# Altium project pi_ups.PrjPcb
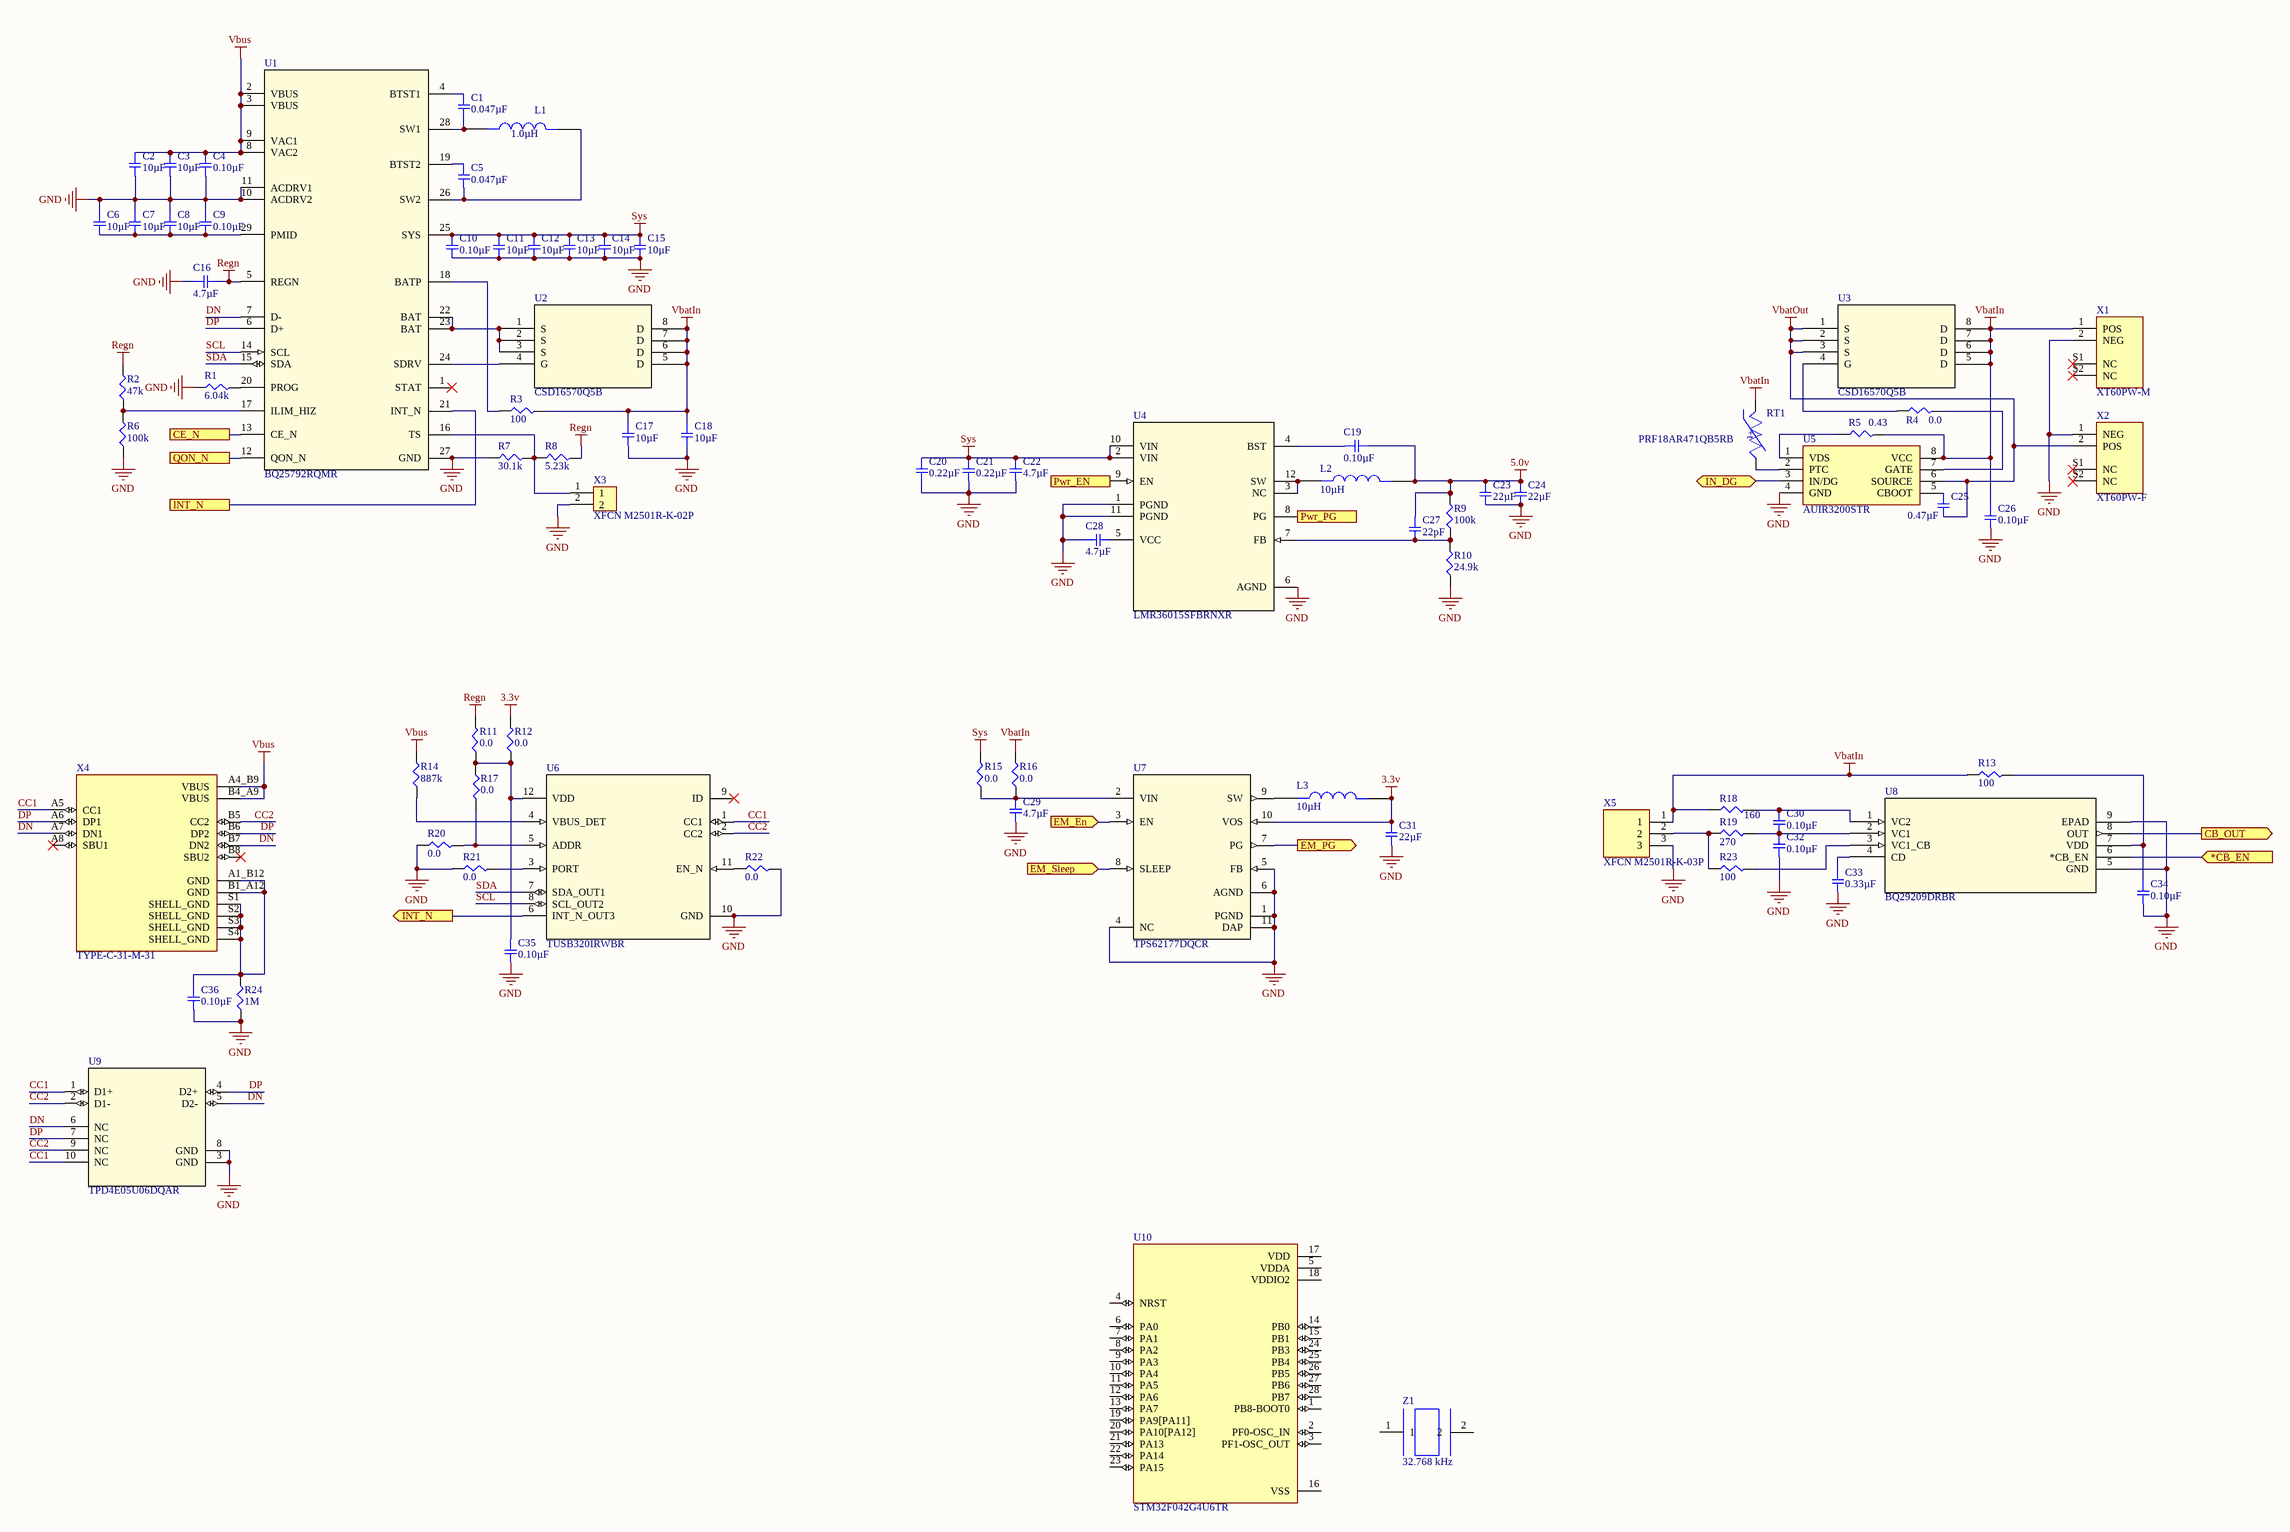
[diagram p0: pi_ups.SchDoc]
1 sheet, 80 parts. Net scope: flat (ports and power ports of the same name join across sheets).

## Sheet pi_ups.SchDoc
size A2; SheetNumber: 1; SheetTotal: 1

### Parts
C1  0.047µF  [SMD-0402C]
C2  10µF  [SMD-0805C]
C3  10µF  [SMD-0805C]
C4  0.10µF  [SMD-0402C]
C5  0.047µF  [SMD-0402C]
C6  10µF  [SMD-0805C]
C7  10µF  [SMD-0805C]
C8  10µF  [SMD-0805C]
C9  0.10µF  [SMD-0402C]
C10  0.10µF  [SMD-0402C]
C11  10µF  [SMD-0805C]
C12  10µF  [SMD-0805C]
C13  10µF  [SMD-0805C]
C14  10µF  [SMD-0805C]
C15  10µF  [SMD-0805C]
C16  4.7µF  [SMD-0805C]
C17  10µF  [SMD-0805C]
C18  10µF  [SMD-0805C]
C19  0.10µF  [SMD-0402C]
C20  0.22µF  [SMD-0603C]
C21  0.22µF  [SMD-0603C]
C22  4.7µF  [SMD-0805C]
C23  22µF  [SMD-0805C]
C24  22µF  [SMD-0805C]
C25  0.47µF  [SMD-0603C]
C26  0.10µF  [SMD-0402C]
C27  22pF  [SMD-0402C]
C28  4.7µF  [SMD-0805C]
C29  4.7µF  [SMD-0805C]
C30  0.10µF  [SMD-0402C]
C31  22µF  [SMD-0805C]
C32  0.10µF  [SMD-0402C]
C33  0.33µF  [SMD-0603C]
C34  0.10µF  [SMD-0402C]
C35  0.10µF  [SMD-0402C]
C36  0.10µF  [SMD-0402C]
L1  1.0µH  [SPM6530T-1R0M120]
L2  10µH  [4020]
L3  10µH  [4020]
R1  6.04k  [SMD-0402-RES]
R2  47k  [SMD-0402-RES]
R3  100  [SMD-0402-RES]
R4  0.0  [SMD-0402-RES]
R5  0.43  [SMD-0402-RES]
R6  100k  [SMD-0402-RES]
R7  30.1k  [SMD-0402-RES]
R8  5.23k  [SMD-0402-RES]
R9  100k  [SMD-0402-RES]
R10  24.9k  [SMD-0402-RES]
R11  0.0  [SMD-0402-RES]
R12  0.0  [SMD-0402-RES]
R13  100  [SMD-0402-RES]
R14  887k  [SMD-0402-RES]
R15  0.0  [SMD-0402-RES]
R16  0.0  [SMD-0402-RES]
R17  0.0  [SMD-0402-RES]
R18  160  [SMD-0402-RES]
R19  270  [SMD-0402-RES]
R20  0.0  [SMD-0402-RES]
R21  0.0  [SMD-0402-RES]
R22  0.0  [SMD-0402-RES]
R23  100  [SMD-0402-RES]
R24  1M  [SMD-0402-RES]
RT1  PRF18AR471QB5RB  [THRMC1608X95N]
U1  BQ25792RQMR  [RQM0029A-MFG]
U2  CSD16570Q5B  [DNK8]
U3  CSD16570Q5B  [DNK8]
U4  LMR36015SFBRNXR  [RNX0012B]
U5  AUIR3200STR  [SOIC127P600X175-8N]
U6  TUSB320IRWBR  [RWB0012A]
U7  TPS62177DQCR  [DQC0010A]
U8  BQ29209DRBR  [DRB8_1P6X2P4]
U9  TPD4E05U06DQAR  [DQA0010A]
U10  STM32F042G4U6TR  [IC_STM32F042G4U6TR]
X1  XT60PW-M  [XT60PW-M]
X2  XT60PW-F  [XT60PW-F]
X3  XFCN M2501R-K-02P  [JST_S2B-XH-A(LF)(SN)]
X4  TYPE-C-31-M-31  [TYPE-C-31-M-31]
X5  XFCN M2501R-K-03P  [JST_S3B-XH-A(LF)(SN)]
Z1  32.768 kHz  [XTAL320X150X90]

### Ports
*CB_EN (in), CB_OUT (out), CE_N, EM_En (in), EM_PG (out), EM_Sleep (in), IN_DG (bidir), INT_N, INT_N (out), Pwr_EN (in), Pwr_PG (out), QON_N

### Nets
3.3v: C31.1 L3.2 R12.2 U7.10(VOS)
5.0v: C19.2 C23.1 C24.1 C27.1 L2.2 R9.2
GND: C2.2 C3.2 C4.2 C6.1 C7.1 C8.1 C9.1 C10.2 C11.2 C12.2 C13.2 C14.2 C15.2 C16.1 C17.2 C18.2 C20.2 C21.2 C22.2 C23.2 C24.2 C26.2 C28.1 C29.2 C31.2 C32.2 C33.2 C34.2 C35.2 C36.2 R1.1 R6.1 R7.1 R10.1 R20.1 R21.1 R22.2 R24.1 U1.10(ACDRV2) U1.11(ACDRV1) U1.27(GND) U4.1(PGND) U4.6(AGND) U4.11(PGND) U5.4(GND) U6.10(GND) U7.1(PGND) U7.4(NC) U7.5(FB) U7.6(AGND) U7.11(DAP) U8.5(GND) U8.9(EPAD) U9.3(GND) U9.8(GND) X1.2(NEG) X2.1(NEG) X3.2 X5.3
Regn: C16.2 R2.2 R8.2 R11.2 U1.5(REGN)
Sys: C10.1 C11.1 C12.1 C13.1 C14.1 C15.1 C20.1 C21.1 C22.1 R15.2 U1.25(SYS) U4.2(VIN) U4.10(VIN)
VbatIn: C17.1 C18.1 C26.1 R3.2 R5.2 R13.1 R16.2 R18.1 RT1.1 U2.5(D) U2.6(D) U2.7(D) U2.8(D) U3.5(D) U3.6(D) U3.7(D) U3.8(D) U5.8(VCC) X1.1(POS) X5.1
VbatOut: C25.2 U3.1(S) U3.2(S) U3.3(S) U5.6(SOURCE) X2.2(POS)
Vbus: C2.1 C3.1 C4.1 R14.2 U1.2(VBUS) U1.3(VBUS) U1.8(VAC2) U1.9(VAC1) X4.A4_B9(VBUS) X4.B4_A9(VBUS)
CC1: U6.1(CC1) U9.1(D1+) U9.10(NC) X4.A5(CC1)
CC2: U6.2(CC2) U9.2(D1-) U9.9(NC) X4.B5(CC2)
DN: U1.7(D-) U9.5(D2-) U9.6(NC) X4.A7(DN1) X4.B7(DN2)
DP: U1.6(D+) U9.4(D2+) U9.7(NC) X4.A6(DP1) X4.B6(DP2)
SCL: U1.14(SCL) U6.8(SCL_OUT2)
SDA: U1.15(SDA) U6.7(SDA_OUT1)
NetC1_1: C1.1 U1.4(BTST1)
NetC1_2: C1.2 L1.1 U1.28(SW1)
NetC5_1: C5.1 U1.19(BTST2)
NetC5_2: C5.2 L1.2 U1.26(SW2)
NetC6_2: C6.2 C7.2 C8.2 C9.2 U1.29(PMID)
NetC19_1: C19.1 U4.4(BST)
NetC25_1: C25.1 U5.5(CBOOT)
NetC27_2: C27.2 R9.1 R10.2 U4.7(FB)
NetC28_2: C28.2 U4.5(VCC)
NetC29_1: C29.1 R15.1 R16.1 U7.2(VIN)
NetC30_1: C30.1 R18.2 U8.1(VC2)
NetC30_2: C30.2 C32.1 R19.2 U8.2(VC1)
NetC33_1: C33.1 U8.4(CD)
NetC34_1: C34.1 R13.2 U8.7(VDD)
NetC35_1: C35.1 R11.1 R12.1 R17.1 U6.12(VDD)
NetC36_1: C36.1 R24.2 X4.A1_B12(GND) X4.B1_A12(GND) X4.S1(SHELL_GND) X4.S2(SHELL_GND) X4.S3(SHELL_GND) X4.S4(SHELL_GND)
NetL2_1: L2.1 U4.3(NC) U4.12(SW)
NetL3_1: L3.1 U7.9(SW)
NetR1_2: R1.2 U1.20(PROG)
NetR2_1: R2.1 R6.2 U1.17(ILIM_HIZ)
NetR3_1: R3.1 U1.18(BATP)
NetR4_1: R4.1 U3.4(G)
NetR4_2: R4.2 U5.7(GATE)
NetR5_1: R5.1 U5.1(VDS)
NetR7_2: R7.2 R8.1 U1.16(TS) X3.1
NetR14_1: R14.1 U6.4(VBUS_DET)
NetR17_2: R17.2 R20.2 U6.5(ADDR)
NetR19_1: R19.1 R23.1 X5.2
NetR21_2: R21.2 U6.3(PORT)
NetR22_1: R22.1 U6.11(EN_N)
NetR23_2: R23.2 U8.3(VC1_CB)
NetRT1_2: RT1.2 U5.2(PTC)
NetU1_12: U1.12(QON_N) ; port QON_N
NetU1_13: U1.13(CE_N) ; port CE_N
NetU1_21: U1.21(INT_N) U6.6(INT_N_OUT3) ; port INT_N
NetU1_22: U1.22(BAT) U1.23(BAT) U2.1(S) U2.2(S) U2.3(S)
NetU1_24: U1.24(SDRV) U2.4(G)
NetU4_8: U4.8(PG) ; port Pwr_PG
NetU4_9: U4.9(EN) ; port Pwr_EN
NetU5_3: U5.3(IN/DG) ; port IN_DG
NetU7_3: U7.3(EN) ; port EM_En
NetU7_7: U7.7(PG) ; port EM_PG
NetU7_8: U7.8(SLEEP) ; port EM_Sleep
NetU8_6: U8.6(*CB_EN) ; port *CB_EN
NetU8_8: U8.8(OUT) ; port CB_OUT

Not connected (* = marked no-connect by the designer): U1 1(STAT)*; U6 9(ID)*; U10 1(PB8-BOOT0) 2(PF0-OSC_IN) 3(PF1-OSC_OUT) 4(NRST) 5(VDDA) 6(PA0) 7(PA1) 8(PA2) 9(PA3) 10(PA4) 11(PA5) 12(PA6) 13(PA7) 14(PB0) 15(PB1) 16(VSS) 17(VDD) 18(VDDIO2) 19(PA9[PA11]) 20(PA10[PA12]) 21(PA13) 22(PA14) 23(PA15) 24(PB3) 25(PB4) 26(PB5) 27(PB6) 28(PB7); X1 S1(NC)* S2(NC)*; X2 S1(NC)* S2(NC)*; X4 A8(SBU1)* B8(SBU2)*; Z1 1 2

### Notes on the sheet
- (in symbol PRF18AR471QB5RB) +t

### Library data of the parts
C1 C5 = GRM155R61H473KE19D: CAP CER 0.047UF 50V X5R 0402; Manufacturer: Murata Electronics North America; Factory Stock: 0; Unit Price (USD): 0.1; Minimum Quantity: 1; Tolerance: ±10%; Datasheets: http://www.murata.com/~/media/webrenewal/support/library/catalog/products/capacitor/mlcc/c02e.pdf; Image: //media.digikey.com/Renders/Murata%20Renders/ZRB-SERIES-0402.jpg; Digi-Key Part Number: 490-12705-1-ND; Part Number: GRM155R61H473KE19D; Quantity Available: 2015; @ qty: 0; Packaging: Cut Tape (CT); Series: GRM; Part Status: Active; Value: 0.047µF; Voltage: 50V; Temperature Coefficient: X5R; Operating Temperature: -55°C ~ 85°C; Features: -; Ratings: -; Applications: General Purpose; Mounting Type: Surface Mount, MLCC; Package / Case: 0402 (1005 Metric); Size / Dimension: 0.039" L x 0.020" W (1.00mm x 0.50mm); Height - Seated (Max): -; Thickness (Max): 0.022" (0.55mm); Lead Spacing: -; Lead Style: -
C2 C3 C6-C8 C11-C15 C17 C18 = GRM21BR6YA106KE43L: CAP CER 10UF 35V X5R 0805; Manufacturer: Murata Electronics North America; Factory Stock: 0; Unit Price (USD): 0.33; Minimum Quantity: 1; Tolerance: ±10%; Datasheets: http://www.murata.com/~/media/webrenewal/support/library/catalog/products/capacitor/mlcc/c02e.pdf; Image: //media.digikey.com/Renders/Murata%20Renders/0805%20(2012%20Metric)%20.85mm.jpg; Digi-Key Part Number: 490-10514-1-ND; Part Number: GRM21BR6YA106KE43L; Quantity Available: 23781; @ qty: 0; Packaging: Cut Tape (CT); Series: GRM; Part Status: Active; Value: 10µF; Voltage: 35V; Temperature Coefficient: X5R; Operating Temperature: -55°C ~ 85°C; Features: Derating Recommended; Ratings: -; Applications: General Purpose; Mounting Type: Surface Mount, MLCC; Package / Case: 0805 (2012 Metric); Size / Dimension: 0.079" L x 0.049" W (2.00mm x 1.25mm); Height - Seated (Max): -; Thickness (Max): 0.057" (1.45mm); Lead Spacing: -; Lead Style: -
C4 C9 C10 C19 C26 C30 C32 C34-C36 = GRM155R71H104ME14D: CAP CER 0.1UF 50V X7R 0402; Manufacturer: Murata Electronics North America; Factory Stock: 0; Unit Price (USD): 0.1; Minimum Quantity: 1; Tolerance: ±20%; Datasheets: http://www.murata.com/~/media/webrenewal/support/library/catalog/products/capacitor/mlcc/c02e.pdf; Image: //media.digikey.com/Renders/Murata%20Renders/ZRB-SERIES-0402.jpg; Digi-Key Part Number: 490-10701-1-ND; Part Number: GRM155R71H104ME14D; Quantity Available: 148884; @ qty: 0; Packaging: Cut Tape (CT); Series: GRM; Part Status: Active; Value: 0.10µF; Voltage: 50V; Temperature Coefficient: X7R; Operating Temperature: -55°C ~ 125°C; Features: -; Ratings: -; Applications: General Purpose; Mounting Type: Surface Mount, MLCC; Package / Case: 0402 (1005 Metric); Size / Dimension: 0.039" L x 0.020" W (1.00mm x 0.50mm); Height - Seated (Max): -; Thickness (Max): 0.022" (0.55mm); Lead Spacing: -; Lead Style: -
C16 C22 C28 C29 = GRM21BR61H475KE51L: CAP CER 4.7UF 50V X5R 0805; Manufacturer: Murata Electronics North America; Factory Stock: 0; Unit Price (USD): 0.37; Minimum Quantity: 1; Tolerance: ±10%; Datasheets: http://www.murata.com/~/media/webrenewal/support/library/catalog/products/capacitor/mlcc/c02e.pdf; Image: //media.digikey.com/Renders/Murata%20Renders/0805%20(2012%20Metric)%20.85mm.jpg; Digi-Key Part Number: 490-10751-1-ND; Part Number: GRM21BR61H475KE51L; Quantity Available: 29522; @ qty: 0; Packaging: Cut Tape (CT); Series: GRM; Part Status: Active; Value: 4.7µF; Voltage: 50V; Temperature Coefficient: X5R; Operating Temperature: -55°C ~ 85°C; Features: -; Ratings: -; Applications: General Purpose; Mounting Type: Surface Mount, MLCC; Package / Case: 0805 (2012 Metric); Size / Dimension: 0.079" L x 0.049" W (2.00mm x 1.25mm); Height - Seated (Max): -; Thickness (Max): 0.055" (1.40mm); Lead Spacing: -; Lead Style: -
C20 C21 = GRM188R61H224KAC4D: CAP CER 0.22UF 50V X5R 0603; Manufacturer: Murata Electronics North America; Factory Stock: 0; Unit Price (USD): 0.2; Minimum Quantity: 1; Tolerance: ±10%; Datasheets: -; Image: //media.digikey.com/Renders/Murata%20Renders/ZRB-SERIES-0402.jpg; Digi-Key Part Number: 490-12739-1-ND; Part Number: GRM188R61H224KAC4D; Quantity Available: 489; @ qty: 0; Packaging: Cut Tape (CT); Series: GRM; Part Status: Active; Value: 0.22µF; Voltage: 50V; Temperature Coefficient: X5R; Operating Temperature: -55°C ~ 85°C; Features: -; Ratings: -; Applications: General Purpose; Mounting Type: Surface Mount, MLCC; Package / Case: 0603 (1608 Metric); Size / Dimension: 0.063" L x 0.031" W (1.60mm x 0.80mm); Height - Seated (Max): -; Thickness (Max): 0.035" (0.90mm); Lead Spacing: -; Lead Style: -
C23 C24 C31 = GRM219R61A226MEA0D: CAP CER 22UF 10V X5R 0805; Manufacturer: Murata Electronics North America; Factory Stock: 0; Unit Price (USD): 0.4; Minimum Quantity: 1; Tolerance: ±20%; Datasheets: http://www.murata.com/~/media/webrenewal/support/library/catalog/products/capacitor/mlcc/c02e.pdf; Image: //media.digikey.com/Renders/Murata%20Renders/0805%20(2012%20Metric)%20.85mm.jpg; Digi-Key Part Number: 490-9951-1-ND; Part Number: GRM219R61A226MEA0D; Quantity Available: 179544; @ qty: 0; Packaging: Cut Tape (CT); Series: GRM; Part Status: Active; Value: 22µF; Voltage: 10V; Temperature Coefficient: X5R; Operating Temperature: -55°C ~ 85°C; Features: Derating Recommended; Ratings: -; Applications: General Purpose; Mounting Type: Surface Mount, MLCC; Package / Case: 0805 (2012 Metric); Size / Dimension: 0.079" L x 0.049" W (2.00mm x 1.25mm); Height - Seated (Max): -; Thickness (Max): 0.037" (0.95mm); Lead Spacing: -; Lead Style: -
C25 = GCM188R71C474KA55D: CAP CER 0.47UF 16V X7R 0603; Manufacturer: Murata Electronics North America; Factory Stock: 0; Unit Price (USD): 0.12; Minimum Quantity: 1; Tolerance: ±10%; Datasheets: http://www.murata.com/~/media/webrenewal/support/library/catalog/products/capacitor/mlcc/c03e.ashx; Image: //media.digikey.com/Renders/Murata%20Renders/0603%28GCM188%29.jpg; Digi-Key Part Number: 490-4775-1-ND; Part Number: GCM188R71C474KA55D; Quantity Available: 73764; @ qty: 0; Packaging: Cut Tape (CT); Series: GCM; Part Status: Active; Value: 0.47µF; Voltage: 16V; Temperature Coefficient: X7R; Operating Temperature: -55°C ~ 125°C; Features: -; Ratings: AEC-Q200; Applications: Automotive; Mounting Type: Surface Mount, MLCC; Package / Case: 0603 (1608 Metric); Size / Dimension: 0.063" L x 0.031" W (1.60mm x 0.80mm); Height - Seated (Max): -; Thickness (Max): 0.035" (0.90mm); Lead Spacing: -; Lead Style: -
C27 = GCM1555C1H220JA16D: CAP CER 22PF 50V NP0 0402; Manufacturer: Murata Electronics North America; Factory Stock: 0; Unit Price (USD): 0.1; Minimum Quantity: 1; Tolerance: ±5%; Temperature Coefficient: C0G, NP0; Datasheets: http://www.murata.com/~/media/webrenewal/support/library/catalog/products/capacitor/mlcc/c03e.ashx; Image: //media.digikey.com/Renders/Murata%20Renders/ZRB-SERIES-0402.jpg; Digi-Key Part Number: 490-9648-1-ND; Part Number: GCM1555C1H220JA16D; Quantity Available: 26532; @ qty: 0; Packaging: Cut Tape (CT); Series: GCM; Part Status: Active; Value: 22pF; Voltage: 50V; Operating Temperature: -55°C ~ 125°C; Features: -; Ratings: AEC-Q200; Applications: Automotive; Mounting Type: Surface Mount, MLCC; Package / Case: 0402 (1005 Metric); Size / Dimension: 0.039" L x 0.020" W (1.00mm x 0.50mm); Height - Seated (Max): -; Thickness (Max): 0.022" (0.55mm); Lead Spacing: -; Lead Style: -
C33 = GCM188R71C334KA37D: CAP CER 0.33UF 16V X7R 0603; Manufacturer: Murata Electronics North America; Factory Stock: 0; Unit Price (USD): 0.19; Minimum Quantity: 1; Tolerance: ±10%; Datasheets: http://www.murata.com/~/media/webrenewal/support/library/catalog/products/capacitor/mlcc/c03e.ashx; Image: //media.digikey.com/Renders/Murata%20Renders/0603%28GCM188%29.jpg; Digi-Key Part Number: 490-6050-1-ND; Part Number: GCM188R71C334KA37D; Quantity Available: 10234; @ qty: 0; Packaging: Cut Tape (CT); Series: GCM; Part Status: Active; Value: 0.33µF; Voltage: 16V; Temperature Coefficient: X7R; Operating Temperature: -55°C ~ 125°C; Features: -; Ratings: AEC-Q200; Applications: Automotive; Mounting Type: Surface Mount, MLCC; Package / Case: 0603 (1608 Metric); Size / Dimension: 0.063" L x 0.031" W (1.60mm x 0.80mm); Height - Seated (Max): -; Thickness (Max): 0.035" (0.90mm); Lead Spacing: -; Lead Style: -
L1 = SPM6530T-1R0M120: Shielded Wirewound Inductor 1.0uH 13.2A 0.0071ohms 7.1x6.5x3mm; Manufacturer: TDK; Package: None; Price: None; Value: 1.0µH; Availability: Unavailable; Part Number: SPM6530T-1R0M120; LCSC Part Number: C87572
L2 L3 = MDA4020-100M: 1.9A 10uH ±20% 1.9A 165mΩ SMD,4.5x4.1x1.8mm Inductors (SMD) ROHS; Manufacturer: KOHERelec; Package: None; Price: None; Value: 10µH; Part Number: MDA4020-100M; Availability: Unavailable; LCSC Part Number: C2847473
R1 = ERJ-2RKF6041X: RES SMD 6.04K OHM 1% 1/10W 0402; Manufacturer: Panasonic Electronic Components; Factory Stock: 0; Unit Price (USD): 0.00496; @ qty: 1500; Minimum Quantity: 1; Power (Watts): 0.1W, 1/10W; Temperature Coefficient: ±100ppm/°C; Part Number: ERJ-2RKF6041X; Datasheets: http://industrial.panasonic.com/www-cgi/jvcr13pz.cgi?E+PZ+3+AOA0002+ERJ2RKF6041X+7+WW; Image: //media.digikey.com/Photos/Panasonic%20Photos/ERJ-PA2-Series.jpg; Digi-Key Part Number: P6.04KLCT-ND; Quantity Available: 368877; Packaging: Cut Tape (CT); Series: ERJ; Part Status: Active; Value: 6.04k; Tolerance: ±1%; Composition: Thick Film; Features: Automotive AEC-Q200; Operating Temperature: -55°C ~ 155°C; Package / Case: 0402 (1005 Metric); Supplier Device Package: 0402; Size / Dimension: 0.039" L x 0.020" W (1.00mm x 0.50mm); Height - Seated (Max): 0.016" (0.40mm); Number of Terminations: 2; Failure Rate: -
R2 = ERJ-2RKF4702X: RES SMD 47K OHM 1% 1/10W 0402; Manufacturer: Panasonic Electronic Components; Factory Stock: 0; Unit Price (USD): 0.00496; @ qty: 1500; Minimum Quantity: 1; Power (Watts): 0.1W, 1/10W; Temperature Coefficient: ±100ppm/°C; Part Number: ERJ-2RKF4702X; Datasheets: http://industrial.panasonic.com/www-cgi/jvcr13pz.cgi?E+PZ+3+AOA0002+ERJ2RKF4702X+7+WW; Image: //media.digikey.com/Photos/Panasonic%20Photos/ERJ-PA2-Series.jpg; Digi-Key Part Number: P47.0KLCT-ND; Quantity Available: 230515; Packaging: Cut Tape (CT); Series: ERJ; Part Status: Active; Value: 47k; Tolerance: ±1%; Composition: Thick Film; Features: Automotive AEC-Q200; Operating Temperature: -55°C ~ 155°C; Package / Case: 0402 (1005 Metric); Supplier Device Package: 0402; Size / Dimension: 0.039" L x 0.020" W (1.00mm x 0.50mm); Height - Seated (Max): 0.016" (0.40mm); Number of Terminations: 2; Failure Rate: -
R3 R13 R23 = ERJ-PA2J101X: RES SMD 100 OHM 5% 1/5W 0402; Manufacturer: Panasonic Electronic Components; Factory Stock: 0; Unit Price (USD): 0.02020; @ qty: 1500; Minimum Quantity: 1; Power (Watts): 0.2W, 1/5W; Temperature Coefficient: ±200ppm/°C; Part Number: ERJ-PA2J101X; Datasheets: https://industrial.panasonic.com/cdbs/www-data/pdf/RDA0000/AOA0000C243.pdf; Image: //media.digikey.com/Photos/Panasonic%20Photos/ERJ-PA2-Series.jpg; Digi-Key Part Number: P17187CT-ND; Quantity Available: 11052; Packaging: Cut Tape (CT); Series: ERJ; Part Status: Active; Value: 100; Tolerance: ±5%; Composition: Thick Film; Features: Automotive AEC-Q200, Pulse Withstanding; Operating Temperature: -55°C ~ 155°C; Package / Case: 0402 (1005 Metric); Supplier Device Package: 0402; Size / Dimension: 0.039" L x 0.020" W (1.00mm x 0.50mm); Height - Seated (Max): 0.016" (0.40mm); Number of Terminations: 2; Failure Rate: -
R4 R11 R12 R15-R17 R20-R22 = ERJ-2GE0R00X: RES SMD 0.0OHM JUMPER 1/10W 0402; Manufacturer: Panasonic Electronic Components; Factory Stock: 0; Unit Price (USD): 0.00384; @ qty: 1500; Minimum Quantity: 1; Power (Watts): 0.1W, 1/10W; Part Number: ERJ-2GE0R00X; Datasheets: http://industrial.panasonic.com/www-cgi/jvcr13pz.cgi?E+PZ+3+AOA0001+ERJ2GE0R00X+7+WW; Image: //media.digikey.com/Photos/Panasonic%20Photos/ERJ-PA2-Series.jpg; Digi-Key Part Number: P0.0JCT-ND; Quantity Available: 3152483; Packaging: Cut Tape (CT); Series: ERJ; Part Status: Active; Value: 0.0; Tolerance: Jumper; Composition: Thick Film; Features: Automotive AEC-Q200; Temperature Coefficient: -; Operating Temperature: -55°C ~ 155°C; Package / Case: 0402 (1005 Metric); Supplier Device Package: 0402; Size / Dimension: 0.039" L x 0.020" W (1.00mm x 0.50mm); Height - Seated (Max): 0.016" (0.40mm); Number of Terminations: 2; Failure Rate: -
R5 = ERJ-2BQFR43X: RES SMD 0.43 OHM 1% 1/6W 0402; Manufacturer: Panasonic Electronic Components; Factory Stock: 0; Unit Price (USD): 0.10080; @ qty: 1500; Minimum Quantity: 1; Power (Watts): 0.167W, 1/6W; Temperature Coefficient: ±250ppm/°C; Part Number: ERJ-2BQFR43X; Datasheets: https://industrial.panasonic.com/cdbs/www-data/pdf/RDA0000/AOA0000C239.pdf; Image: //media.digikey.com/Photos/Panasonic%20Photos/ERJ-PA2-Series.jpg; Digi-Key Part Number: P.43AKCT-ND; Quantity Available: 26414; Packaging: Cut Tape (CT); Series: ERJ; Part Status: Active; Value: 0.43; Tolerance: ±1%; Composition: Thick Film; Features: Automotive AEC-Q200, Current Sense; Operating Temperature: -55°C ~ 125°C; Package / Case: 0402 (1005 Metric); Supplier Device Package: 0402; Size / Dimension: 0.039" L x 0.020" W (1.00mm x 0.50mm); Height - Seated (Max): 0.016" (0.40mm); Number of Terminations: 2; Failure Rate: -
R6 R9 = ERJ-2RKF1003X: RES SMD 100K OHM 1% 1/10W 0402; Manufacturer: Panasonic Electronic Components; Factory Stock: 0; Unit Price (USD): 0.00496; @ qty: 1500; Minimum Quantity: 1; Power (Watts): 0.1W, 1/10W; Temperature Coefficient: ±100ppm/°C; Part Number: ERJ-2RKF1003X; Datasheets: http://industrial.panasonic.com/www-cgi/jvcr13pz.cgi?E+PZ+3+AOA0002+ERJ2RKF1003X+7+WW; Image: //media.digikey.com/Photos/Panasonic%20Photos/ERJ-PA2-Series.jpg; Digi-Key Part Number: P100KLCT-ND; Quantity Available: 2645965; Packaging: Cut Tape (CT); Series: ERJ; Part Status: Active; Value: 100k; Tolerance: ±1%; Composition: Thick Film; Features: Automotive AEC-Q200; Operating Temperature: -55°C ~ 155°C; Package / Case: 0402 (1005 Metric); Supplier Device Package: 0402; Size / Dimension: 0.039" L x 0.020" W (1.00mm x 0.50mm); Height - Seated (Max): 0.016" (0.40mm); Number of Terminations: 2; Failure Rate: -
R7 = ERJ-2RKF3012X: RES SMD 30.1K OHM 1% 1/10W 0402; Manufacturer: Panasonic Electronic Components; Factory Stock: 0; Unit Price (USD): 0.00496; @ qty: 1500; Minimum Quantity: 1; Power (Watts): 0.1W, 1/10W; Temperature Coefficient: ±100ppm/°C; Part Number: ERJ-2RKF3012X; Datasheets: http://industrial.panasonic.com/www-cgi/jvcr13pz.cgi?E+PZ+3+AOA0002+ERJ2RKF3012X+7+WW; Image: //media.digikey.com/Photos/Panasonic%20Photos/ERJ-PA2-Series.jpg; Digi-Key Part Number: P30.1KLCT-ND; Quantity Available: 32482; Packaging: Cut Tape (CT); Series: ERJ; Part Status: Active; Value: 30.1k; Tolerance: ±1%; Composition: Thick Film; Features: Automotive AEC-Q200; Operating Temperature: -55°C ~ 155°C; Package / Case: 0402 (1005 Metric); Supplier Device Package: 0402; Size / Dimension: 0.039" L x 0.020" W (1.00mm x 0.50mm); Height - Seated (Max): 0.016" (0.40mm); Number of Terminations: 2; Failure Rate: -
R8 = ERJ-2RKF5231X: RES SMD 5.23K OHM 1% 1/10W 0402; Manufacturer: Panasonic Electronic Components; Factory Stock: 0; Unit Price (USD): 0.00496; @ qty: 1500; Minimum Quantity: 1; Power (Watts): 0.1W, 1/10W; Temperature Coefficient: ±100ppm/°C; Part Number: ERJ-2RKF5231X; Datasheets: http://industrial.panasonic.com/www-cgi/jvcr13pz.cgi?E+PZ+3+AOA0002+ERJ2RKF5231X+7+WW; Image: //media.digikey.com/Photos/Panasonic%20Photos/ERJ-PA2-Series.jpg; Digi-Key Part Number: P5.23KLCT-ND; Quantity Available: 102004; Packaging: Cut Tape (CT); Series: ERJ; Part Status: Active; Value: 5.23k; Tolerance: ±1%; Composition: Thick Film; Features: Automotive AEC-Q200; Operating Temperature: -55°C ~ 155°C; Package / Case: 0402 (1005 Metric); Supplier Device Package: 0402; Size / Dimension: 0.039" L x 0.020" W (1.00mm x 0.50mm); Height - Seated (Max): 0.016" (0.40mm); Number of Terminations: 2; Failure Rate: -
R10 = ERJ-2RKF2492X: RES SMD 24.9K OHM 1% 1/10W 0402; Manufacturer: Panasonic Electronic Components; Factory Stock: 0; Unit Price (USD): 0.00496; @ qty: 1500; Minimum Quantity: 1; Power (Watts): 0.1W, 1/10W; Temperature Coefficient: ±100ppm/°C; Part Number: ERJ-2RKF2492X; Datasheets: http://industrial.panasonic.com/www-cgi/jvcr13pz.cgi?E+PZ+3+AOA0002+ERJ2RKF2492X+7+WW; Image: //media.digikey.com/Photos/Panasonic%20Photos/ERJ-PA2-Series.jpg; Digi-Key Part Number: P24.9KLCT-ND; Quantity Available: 116711; Packaging: Cut Tape (CT); Series: ERJ; Part Status: Active; Value: 24.9k; Tolerance: ±1%; Composition: Thick Film; Features: Automotive AEC-Q200; Operating Temperature: -55°C ~ 155°C; Package / Case: 0402 (1005 Metric); Supplier Device Package: 0402; Size / Dimension: 0.039" L x 0.020" W (1.00mm x 0.50mm); Height - Seated (Max): 0.016" (0.40mm); Number of Terminations: 2; Failure Rate: -
R14 = ERJ-2RKF8873X: RES SMD 887K OHM 1% 1/10W 0402; Manufacturer: Panasonic Electronic Components; Factory Stock: 0; Unit Price (USD): 0.00408; @ qty: 1500; Minimum Quantity: 1; Power (Watts): 0.1W, 1/10W; Temperature Coefficient: ±100ppm/°C; Part Number: ERJ-2RKF8873X; Datasheets: http://industrial.panasonic.com/www-cgi/jvcr13pz.cgi?E+PZ+3+AOA0002+ERJ2RKF8873X+7+WW; Image: //media.digikey.com/Photos/Panasonic%20Photos/ERJ-PA2-Series.jpg; Digi-Key Part Number: P887KLCT-ND; Quantity Available: 36244; Packaging: Cut Tape (CT); Series: ERJ; Part Status: Active; Value: 887k; Tolerance: ±1%; Composition: Thick Film; Features: Automotive AEC-Q200; Operating Temperature: -55°C ~ 155°C; Package / Case: 0402 (1005 Metric); Supplier Device Package: 0402; Size / Dimension: 0.039" L x 0.020" W (1.00mm x 0.50mm); Height - Seated (Max): 0.016" (0.40mm); Number of Terminations: 2; Failure Rate: -
R18 = ERJ-2GEJ161X: RES SMD 160 OHM 5% 1/10W 0402; Manufacturer: Panasonic Electronic Components; Factory Stock: 0; Unit Price (USD): 0.00350; @ qty: 1500; Minimum Quantity: 1; Power (Watts): 0.1W, 1/10W; Temperature Coefficient: ±200ppm/°C; Part Number: ERJ-2GEJ161X; Datasheets: http://industrial.panasonic.com/www-cgi/jvcr13pz.cgi?E+PZ+3+AOA0001+ERJ2GEJ161X+7+WW; Image: //media.digikey.com/Photos/Panasonic%20Photos/ERJ-PA2-Series.jpg; Digi-Key Part Number: P160JCT-ND; Quantity Available: 103224; Packaging: Cut Tape (CT); Series: ERJ; Part Status: Active; Value: 160; Tolerance: ±5%; Composition: Thick Film; Features: Automotive AEC-Q200; Operating Temperature: -55°C ~ 155°C; Package / Case: 0402 (1005 Metric); Supplier Device Package: 0402; Size / Dimension: 0.039" L x 0.020" W (1.00mm x 0.50mm); Height - Seated (Max): 0.016" (0.40mm); Number of Terminations: 2; Failure Rate: -
R19 = ERJ-2GEJ271X: RES SMD 270 OHM 5% 1/10W 0402; Manufacturer: Panasonic Electronic Components; Factory Stock: 0; Unit Price (USD): 0.00350; @ qty: 1500; Minimum Quantity: 1; Power (Watts): 0.1W, 1/10W; Temperature Coefficient: ±200ppm/°C; Part Number: ERJ-2GEJ271X; Datasheets: http://industrial.panasonic.com/www-cgi/jvcr13pz.cgi?E+PZ+3+AOA0001+ERJ2GEJ271X+7+WW; Image: //media.digikey.com/Photos/Panasonic%20Photos/ERJ-PA2-Series.jpg; Digi-Key Part Number: P270JCT-ND; Quantity Available: 86444; Packaging: Cut Tape (CT); Series: ERJ; Part Status: Active; Value: 270; Tolerance: ±5%; Composition: Thick Film; Features: Automotive AEC-Q200; Operating Temperature: -55°C ~ 155°C; Package / Case: 0402 (1005 Metric); Supplier Device Package: 0402; Size / Dimension: 0.039" L x 0.020" W (1.00mm x 0.50mm); Height - Seated (Max): 0.016" (0.40mm); Number of Terminations: 2; Failure Rate: -
R24 = ERJ-PA2J105X: RES SMD 1M OHM 5% 1/5W 0402; Manufacturer: Panasonic Electronic Components; Factory Stock: 0; Unit Price (USD): 0.02020; @ qty: 1500; Minimum Quantity: 1; Power (Watts): 0.2W, 1/5W; Temperature Coefficient: ±200ppm/°C; Part Number: ERJ-PA2J105X; Datasheets: https://industrial.panasonic.com/cdbs/www-data/pdf/RDA0000/AOA0000C243.pdf; Image: //media.digikey.com/Photos/Panasonic%20Photos/ERJ-PA2-Series.jpg; Digi-Key Part Number: P17211CT-ND; Quantity Available: 9055; Packaging: Cut Tape (CT); Series: ERJ; Part Status: Active; Value: 1M; Tolerance: ±5%; Composition: Thick Film; Features: Automotive AEC-Q200, Pulse Withstanding; Operating Temperature: -55°C ~ 155°C; Package / Case: 0402 (1005 Metric); Supplier Device Package: 0402; Size / Dimension: 0.039" L x 0.020" W (1.00mm x 0.50mm); Height - Seated (Max): 0.016" (0.40mm); Number of Terminations: 2; Failure Rate: -
RT1 = PRF18AR471QB5RB: PTC Thermistor 470 Ohms 0603 (1608 Metric); Manufacturer: Murata Electronics North America; Value: 470; Package: None; Price: None; Availability: Unavailable; Part Number: PRF18AR471QB5RB; LCSC Part Number: C152554
U1 = BQ25792RQMR: I2C controlled, 5-A, 1-4 cell buck-boost charger with dual-input selector and USB PD 3.0 OTG output; Manufacturer: Texas Instruments; Type: DEV; RefDes: RefDes; Copyright: Copyright (C) 2022 Ultra Librarian. All rights reserved.; Part Number: BQ25792RQMR; ComponentLink1Description: Manufacturer_link; ComponentLink1URL: https://www.ti.com/product/BQ25792; LCSC Part Number: C2862876
U2 U3 = CSD16570Q5B: 25-V, N channel NexFET™ power MOSFET, single SON 5 mm x 6 mm, 0.82 mOhm; Manufacturer: Texas Instruments; Copyright: Copyright (C) 2022 Ultra Librarian. All rights reserved.; RefDes: RefDes; Type: DEV; Part Number: CSD16570Q5B; ComponentLink1Description: Manufacturer_link; ComponentLink1URL: https://www.ti.com/store/ti/en/p/product/?p=CSD16570Q5B; LCSC Part Number: C473359
U4 = LMR36015SFBRNXR: 4.2-V to 60-V, 1.5-A ultra-small synchronous step-down converter with extended temperature; Manufacturer: Texas Instruments; Type: DEV; RefDes: RefDes; Copyright: Copyright (C) 2022 Ultra Librarian. All rights reserved.; Part Number: LMR36015SFBRNXR; ComponentLink1Description: Manufacturer_link; ComponentLink1URL: https://www.ti.com/store/ti/en/p/product/?p=LMR36015SFBRNXR
U5 = AUIR3200STR: High side mosfet driver for very low Rdson automotive application with over-current, over-temperature protection and diagnostic.; Manufacturer: Infineon Technologies; Datasheet Link: https://componentsearchengine.com/Datasheets/2/AUIR3200STR.pdf; Height: 1.75mm; Part Number: AUIR3200STR; ComponentLink1Description: Manufacturer_link; ComponentLink1URL: https://www.infineon.com/cms/en/product/power/gate-driver-ics/auir3200s/; LCSC Part Number: C97698
U6 = TUSB320IRWBR: USB Type-C configuration channel logic and port control; Manufacturer: Texas Instruments; Type: DEV; RefDes: RefDes; Copyright: Copyright (C) 2022 Ultra Librarian. All rights reserved.; Part Number: TUSB320IRWBR; ComponentLink1Description: Manufacturer_link; ComponentLink1URL: https://www.ti.com/store/ti/en/p/product/?p=TUSB320IRWBR; LCSC Part Number: C80170
U7 = TPS62177DQCR: 28V, 0.5A Step-Down Converter with SNOOZE Mode; Manufacturer: Texas Instruments; Type: DEV; RefDes: RefDes; Copyright: Copyright (C) 2022 Ultra Librarian. All rights reserved.; Part Number: TPS62177DQCR; ComponentLink1Description: Manufacturer_link; ComponentLink1URL: https://www.ti.com/store/ti/en/p/product/?p=TPS62177DQCR; LCSC Part Number: C91241
U8 = BQ29209DRBR: Voltage Protection with Automatic Cell Balance For 2-Cell Li-Ion Batteries, OVP=4.30V; Manufacturer: Texas Instruments; Copyright: Copyright (C) 2022 Ultra Librarian. All rights reserved.; RefDes: RefDes; Type: DEV; ComponentLink1Description: Manufacturer_link; ComponentLink1URL: https://www.ti.com/store/ti/en/p/product/?p=BQ29209DRBR; Part Number: BQ29209DRBR; LCSC Part Number: C139352
U9 = TPD4E05U06DQAR: Quad 0.5-pF, 5.5-V, ±12-kV ESD protection diode for USB,  HDMI & High Speed Interfaces; Manufacturer: Texas Instruments; CompType: IC; Type: DEV; RefDes: RefDes; Copyright: Copyright (C) 2022 Ultra Librarian. All rights reserved.; Application_BuildNumber: *; Part Number: TPD4E05U06DQAR; PackageReference: DQA0010A; MountType: SMT; RoHS: Y; ComponentLink1Description: Manufacturer_link; ComponentLink1URL: https://www.ti.com/store/ti/en/p/product/?p=TPD4E05U06DQAR; LCSC Part Number: C138714
U10 = STM32F042G4U6TR: ARM® Cortex®-M0 STM32F0 Microcontroller IC 32-Bit 48MHz 32KB (32K x 8) FLASH 28-UFQFPN (4x4); Manufacturer: STMicroelectronics; Package: None; Price: None; Value: *; Part Number: STM32F042G4U6TR; Availability: Unavailable; LCSC Part Number: C88048
X1 = XT60PW-M: Socket, DC supply, male, PIN: 2; Manufacturer: AMASS; Package: Package; SnapEDA_Link: https://www.snapeda.com/parts/XT60PW-M/AMASS/view-part/?ref=snap; Value: *; Availability: Not in stock; Price: None; Check_prices: https://www.snapeda.com/parts/XT60PW-M/AMASS/view-part/?ref=eda; Part Number: XT60PW-M; LCSC Part Number: C98732
X2 = XT60PW-F: Socket DC Supply Connector Female; Manufacturer: AMASS; Availability: Unavailable; SnapEDA_Link: https://www.snapeda.com/parts/XT60PW-F/AMASS/view-part/2890674/?ref=snap; Value: *; Price: None; Package: Package; Part Number: XT60PW-F
X3 = XFCN M2501R-K-02P: Connector Header Through Hole, Right Angle 2 position 0.098 (2.50mm); Package: None; Part Number: M2501R-K-02P; Value: *; Price: None; Manufacturer: XFCN; Availability: In Stock; LCSC Part Number: C492474
X4 = TYPE-C-31-M-31: 5A 1 Surface Mount 16 Female -30℃~+80℃ Type-C SMD USB Connectors ROHS; Manufacturer: Korean Hroparts Elec; Price: None; Value: *; Part Number: TYPE-C-31-M-31; Package: None; Availability: Warning; LCSC Part Number: C2760486
X5 = XFCN M2501R-K-03P: Connector Header Through Hole, Right Angle 3 position 0.098 (2.50mm); Part Number: M2501R-K-03P; Availability: Unavailable; Manufacturer: XFCN; Package: FakePackage u; Value: *; Price: None; LCSC Part Number: C492475
Z1 = FC-12M 32.7680KA-A5: 32.768kHz SMD Crystal Resonator 12.5pF 90kΩ ±20ppm -40℃~+85℃ SMD2012-2P Crystals ROHS; Manufacturer: Seiko Epson; Package: SMD2012-2P; Value: 32.768 kHz; Part Number: FC-12M 32.7680KA-A5; Availability: Unavailable; SnapEDA_Link: https://www.snapeda.com/parts/ABS07-32.768KHZ-9/Abracon%20LLC/view-part/517712/?ref=snap; Price: None; LCSC Part Number: C1985211